# EAGLE schematic Aquila-2018-Under-DESKTOP-4DKEQLF (EAGLE 9.1.1)
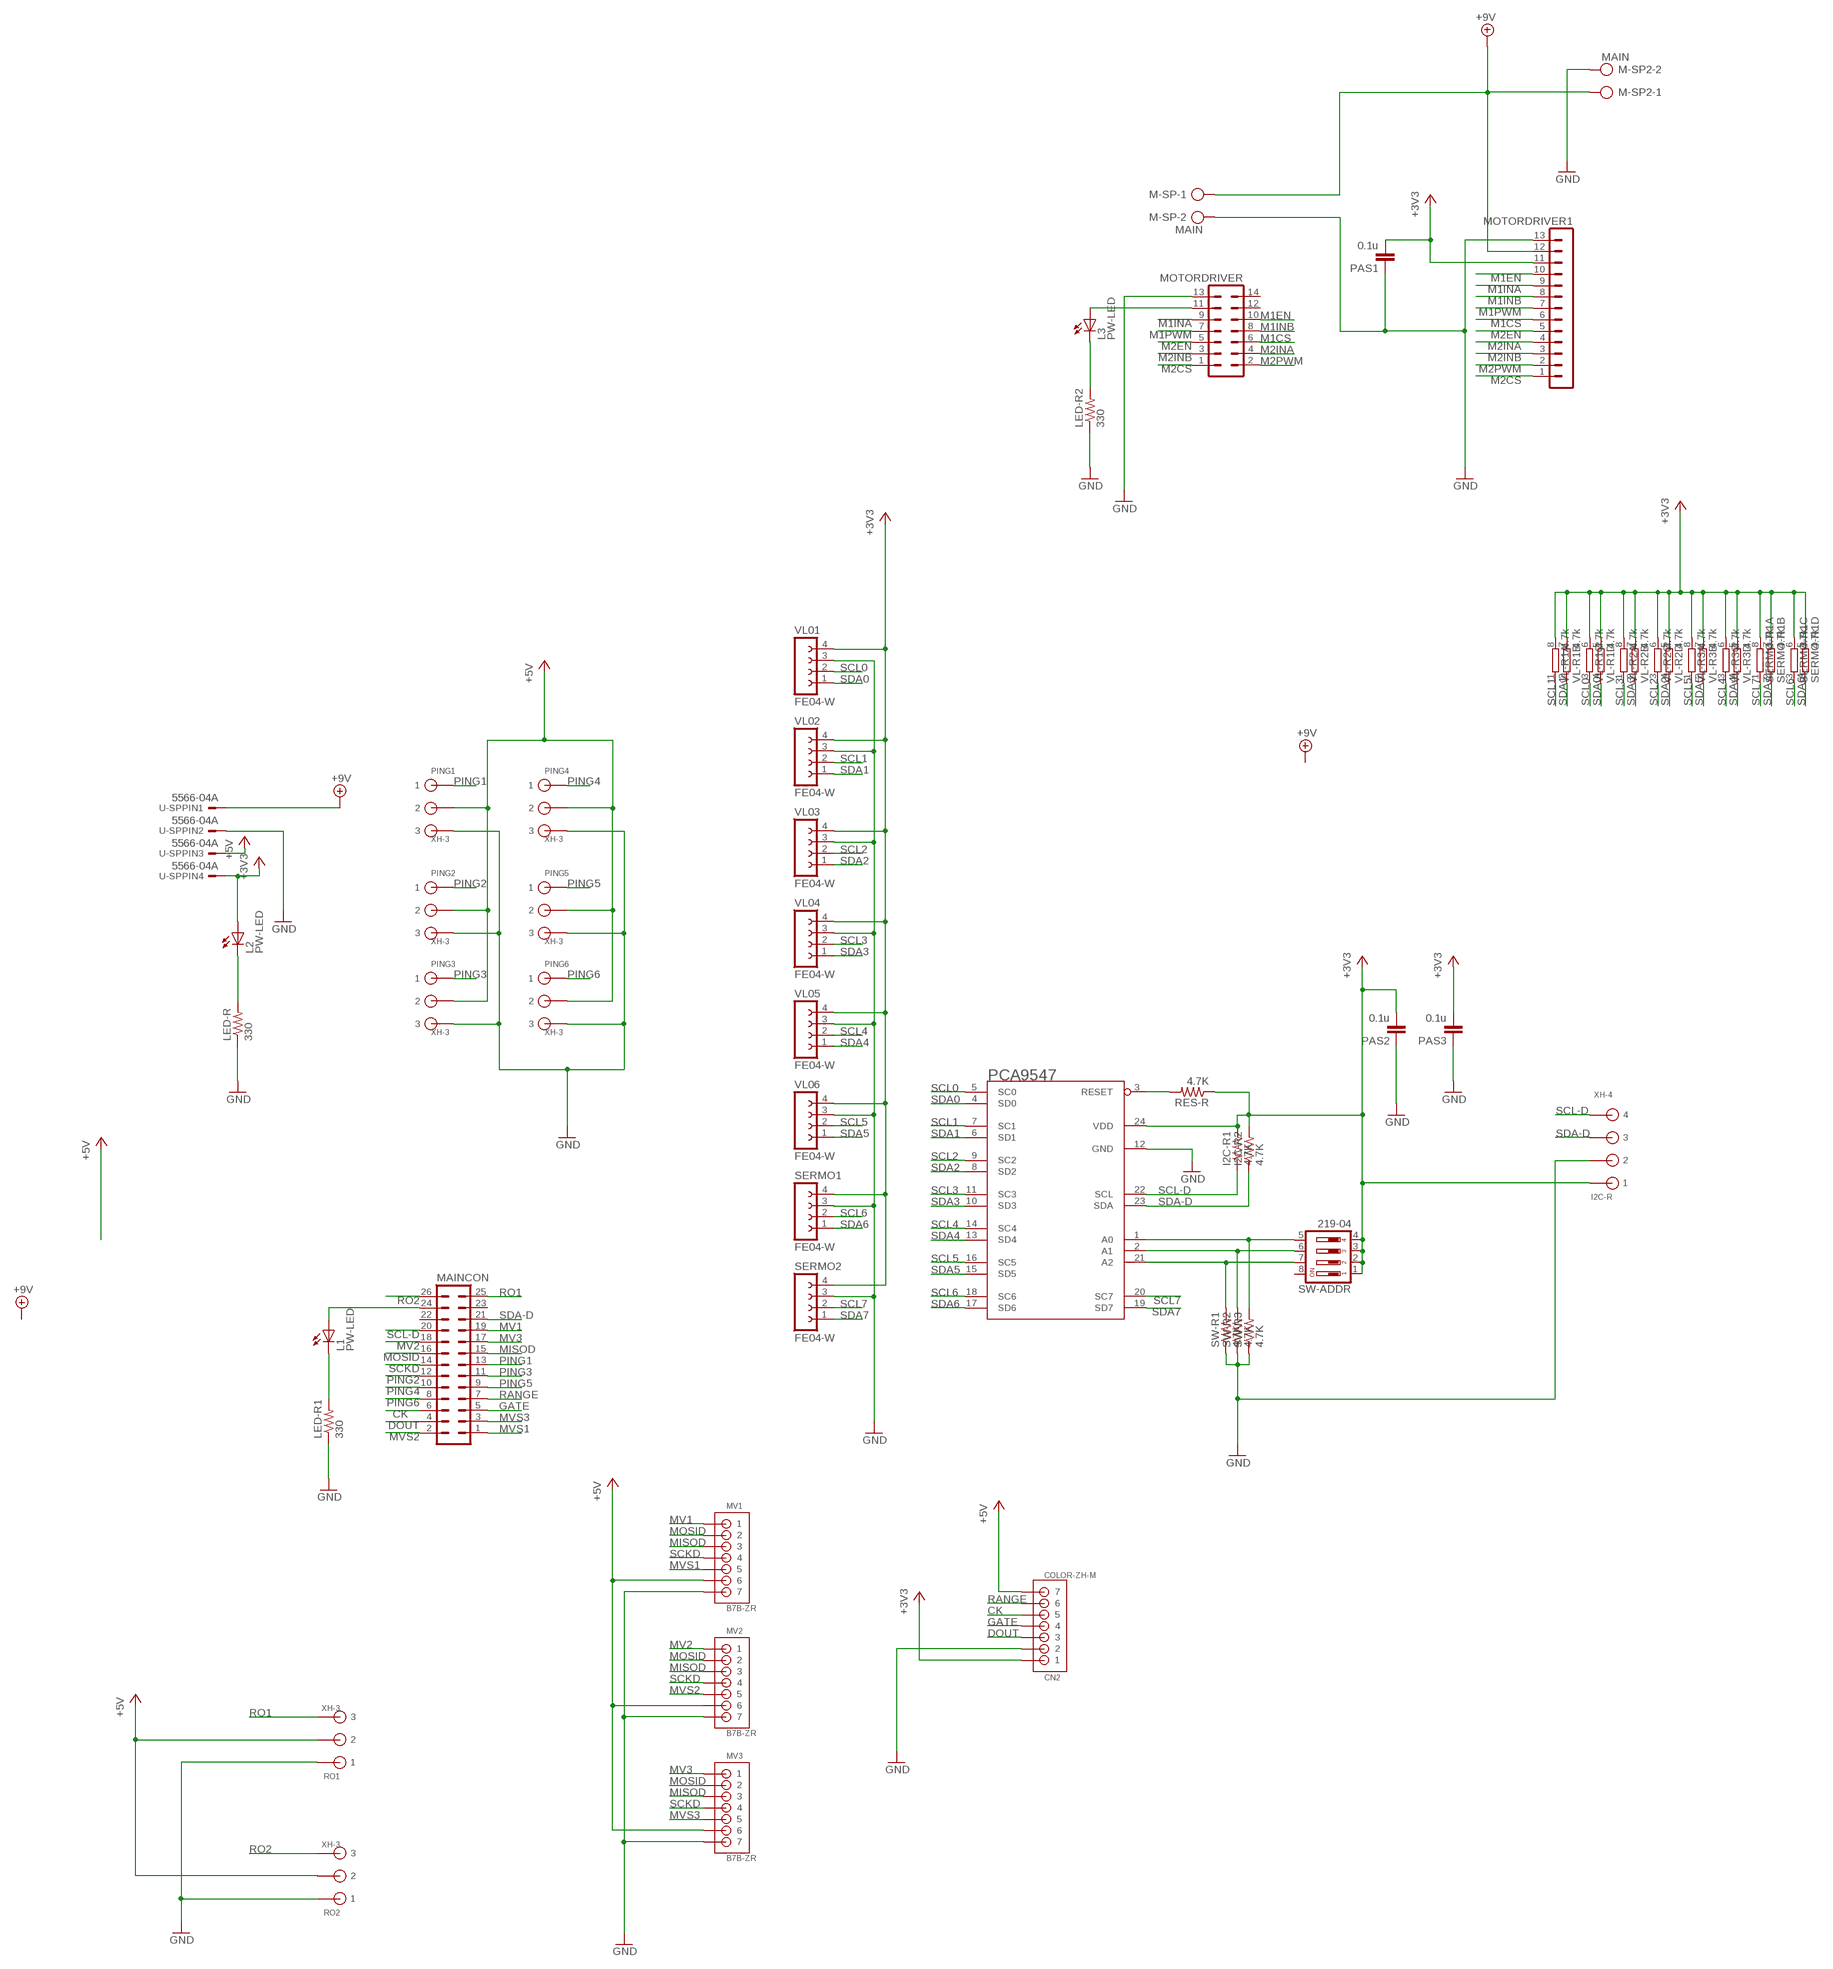
[diagram p0: schematic, sheet 1]

## Parts
CN2  COLOR-ZH-M  B7B-ZR  [B7B-ZR]
I2C-R  XH-4  [CON4]
I2C-R1  4.7K  R-US_R0805  [R0805]
I2C-R2  4.7K  R-US_R0805  [R0805]
L1  PW-LED  LEDCHIPLED_0805  [CHIPLED_0805]
L2  PW-LED  LEDCHIPLED_0805  [CHIPLED_0805]
L3  PW-LED  LEDCHIPLED_0805  [CHIPLED_0805]
LED-R  330  R-US_R0805  [R0805]
LED-R1  330  R-US_R0805  [R0805]
LED-R2  330  R-US_R0805  [R0805]
M-SP  MAIN  AK500/2  [AK500/2]
M-SP2  MAIN  AK500/2  [AK500/2]
MAINCON  ML26  [ML26]
MOTORDRIVER  ML14  [ML14]
MOTORDRIVER1  MA13-1  [MA13-1]
MV1  B7B-ZR  [B7B-ZR]
MV2  B7B-ZR  [B7B-ZR]
MV3  B7B-ZR  [B7B-ZR]
PAS1  0.1u  C-EUC0805  [C0805]
PAS2  0.1u  C-EUC0805  [C0805]
PAS3  0.1u  C-EUC0805  [C0805]
PCA9547  PCA9547  [SO24L]
PING1  XH-3  [CON3]
PING2  XH-3  [CON3]
PING3  XH-3  [CON3]
PING4  XH-3  [CON3]
PING5  XH-3  [CON3]
PING6  XH-3  [CON3]
RES-R  4.7K  R-US_R0805  [R0805]
RO1  XH-3  [CON3]
RO2  XH-3  [CON3]
SERMO1  FE04-W  [FE04-W]
SERMO2  FE04-W  [FE04-W]
SERMO-R1  4.7k  4R-NEXB28V  [EXB28V]
SW-ADDR  219-04  [CTS-219-04]
SW-R1  4.7K  R-US_R0805  [R0805]
SW-R2  4.7K  R-US_R0805  [R0805]
SW-R3  4.7K  R-US_R0805  [R0805]
U-SP  5566-04A  [5566-04A]
VL01  FE04-W  [FE04-W]
VL02  FE04-W  [FE04-W]
VL03  FE04-W  [FE04-W]
VL04  FE04-W  [FE04-W]
VL05  FE04-W  [FE04-W]
VL06  FE04-W  [FE04-W]
VL-R1  4.7k  4R-NEXB28V  [EXB28V]
VL-R2  4.7k  4R-NEXB28V  [EXB28V]
VL-R3  4.7k  4R-NEXB28V  [EXB28V]

## Nets
+3V3: CN2.1 I2C-R1.2 I2C-R2.2 I2C-R.P$1 L2.A MOTORDRIVER1.11 PAS1.2 PAS2.2 PAS3.2 PCA9547.24(VDD) RES-R.1 SERMO1.4 SERMO2.4 SERMO-R1.5 SERMO-R1.6 SERMO-R1.7 SERMO-R1.8 SW-ADDR.1 SW-ADDR.2 SW-ADDR.3 SW-ADDR.4 U-SP.4 VL01.4 VL02.4 VL03.4 VL04.4 VL05.4 VL06.4 VL-R1.5 VL-R1.6 VL-R1.7 VL-R1.8 VL-R2.5 VL-R2.6 VL-R2.7 VL-R2.8 VL-R3.5 VL-R3.6 VL-R3.7 VL-R3.8
+5V: CN2.7 MV1.6 MV2.6 MV3.6 PING1.P$2 PING2.P$2 PING3.P$2 PING4.P$2 PING5.P$2 PING6.P$2 RO1.P$2 RO2.P$2 U-SP.3
+9V: M-SP2.1 M-SP.1 MOTORDRIVER1.12 U-SP.1
CK: CN2.5 MAINCON.6
DOUT: CN2.3 MAINCON.4
GATE: CN2.4 MAINCON.5
GND: CN2.2 I2C-R.P$2 LED-R1.1 LED-R2.1 LED-R.1 M-SP2.2 M-SP.2 MOTORDRIVER1.13 MOTORDRIVER.13 MV1.7 MV2.7 MV3.7 PAS1.1 PAS2.1 PAS3.1 PCA9547.12(GND) PING1.P$3 PING2.P$3 PING3.P$3 PING4.P$3 PING5.P$3 PING6.P$3 RO1.P$1 RO2.P$1 SERMO1.3 SERMO2.3 SW-R1.1 SW-R2.1 SW-R3.1 U-SP.2 VL01.3 VL02.3 VL03.3 VL04.3 VL05.3 VL06.3
M1CS: MOTORDRIVER1.6 MOTORDRIVER.6
M1EN: MOTORDRIVER1.10 MOTORDRIVER.10
M1INA: MOTORDRIVER1.9 MOTORDRIVER.9
M1INB: MOTORDRIVER1.8 MOTORDRIVER.8
M1PWM: MOTORDRIVER1.7 MOTORDRIVER.7
M2CS: MOTORDRIVER1.1 MOTORDRIVER.1
M2EN: MOTORDRIVER1.5 MOTORDRIVER.5
M2INA: MOTORDRIVER1.4 MOTORDRIVER.4
M2INB: MOTORDRIVER1.3 MOTORDRIVER.3
M2PWM: MOTORDRIVER1.2 MOTORDRIVER.2
MISOD: MAINCON.15 MV1.3 MV2.3 MV3.3
MOSID: MAINCON.16 MV1.2 MV2.2 MV3.2
MV1: MAINCON.19 MV1.1
MV2: MAINCON.18 MV2.1
MV3: MAINCON.17 MV3.1
MVS1: MAINCON.1 MV1.5
MVS2: MAINCON.2 MV2.5
MVS3: MAINCON.3 MV3.5
N$1: PCA9547.1(A0) SW-ADDR.5 SW-R3.2
N$2: PCA9547.2(A1) SW-ADDR.6 SW-R2.2
N$3: PCA9547.21(A2) SW-ADDR.7 SW-R1.2
N$4: L2.C LED-R.2
N$5: PCA9547.3(RESET) RES-R.2
N$7: L1.C LED-R1.2
N$8: L1.A MAINCON.24
N$9: L3.C LED-R2.2
N$10: L3.A MOTORDRIVER.11
PING1: MAINCON.13 PING1.P$1
PING2: MAINCON.12 PING2.P$1
PING3: MAINCON.11 PING3.P$1
PING4: MAINCON.10 PING4.P$1
PING5: MAINCON.9 PING5.P$1
PING6: MAINCON.8 PING6.P$1
RANGE: CN2.6 MAINCON.7
RO1: MAINCON.25 RO1.P$3
RO2: MAINCON.26 RO2.P$3
SCKD: MAINCON.14 MV1.4 MV2.4 MV3.4
SCL0: PCA9547.5(SC0) VL01.2 VL-R1.3
SCL1: PCA9547.7(SC1) VL02.2 VL-R1.1
SCL2: PCA9547.9(SC2) VL03.2 VL-R2.3
SCL3: PCA9547.11(SC3) VL04.2 VL-R2.1
SCL4: PCA9547.14(SC4) VL05.2 VL-R3.3
SCL5: PCA9547.16(SC5) VL06.2 VL-R3.1
SCL6: PCA9547.18(SC6) SERMO1.2 SERMO-R1.3
SCL7: PCA9547.20(SC7) SERMO2.2 SERMO-R1.1
SCL-D: I2C-R1.1 I2C-R.P$4 MAINCON.20 PCA9547.22(SCL)
SDA0: PCA9547.4(SD0) VL01.1 VL-R1.4
SDA1: PCA9547.6(SD1) VL02.1 VL-R1.2
SDA2: PCA9547.8(SD2) VL03.1 VL-R2.4
SDA3: PCA9547.10(SD3) VL04.1 VL-R2.2
SDA4: PCA9547.13(SD4) VL05.1 VL-R3.4
SDA5: PCA9547.15(SD5) VL06.1 VL-R3.2
SDA6: PCA9547.17(SD6) SERMO1.1 SERMO-R1.4
SDA7: PCA9547.19(SD7) SERMO2.1 SERMO-R1.2
SDA-D: I2C-R2.1 I2C-R.P$3 MAINCON.21 PCA9547.23(SDA)
Unconnected: MAINCON.22 MAINCON.23 MOTORDRIVER.12 MOTORDRIVER.14 SW-ADDR.8

## Library data of the parts
CN2 MV1-MV3 = jst:B7B-ZR
I2C-R = 0@Mylibrary-main1:XH-4: Low insertion connector 4pin
I2C-R1 I2C-R2 LED-R LED-R1 LED-R2 RES-R SW-R1-SW-R3 = 0@Mylibrary-main1:R-US_: RESISTOR, American symbol
L1-L3 = led:LED: LED OSRAM: - CHIPLED LG R971, LG N971, LY N971, LG Q971, LY Q971, LO R971, LY R971 LH N974, LH R974 LS Q976, LO Q976, LY Q976 LO Q996 - Hyper CHIPLED LW Q18S LB Q993, LB Q99A, LB R99A - SideLED LS A670, LO A670, LY A670, LG A670, LP A670 LB A673, LV A673, LT A673, LW A673 LH A674 LY A675 LS A676, LA A676, LO A676, LY A676, LW A676 LS A679, LY A679, LG A679 - Hyper Micro SIDELED® LS Y876, LA Y876, LO Y876, LY Y876 LT Y87S - SmartLED LW L88C, LW L88S LB L89C, LB L89S, LG L890 LS L89K, LO L89K, LY L89K LS L896, LA L896, LO L896, LY L896 - TOPLED LS T670, LO T670, LY T670, LG T670, LP T670 LSG T670, LSP T670, LSY T670, LOP T670, LYG T670 LG T671, LOG T671, LSG T671 LB T673, LV T673, LT T673, LW T673 LH T674 LS T676, LA T676, LO T676, LY T676, LB T676, LH T676, LSB T676, LW T676 LB T67C, LV T67C, LT T67C, LS T67K, LO T67K, LY T67K, LW E67C LS E67B, LA E67B, LO E67B, LY E67B, LB E67C, LV E67C, LT E67C LW T67C LS T679, LY T679, LG T679 LS T770, LO T770, LY T770, LG T770, LP T770 LB T773, LV T773, LT T773, LW T773 LH T774 LS E675, LA E675, LY E675, LS T675 LS T776, LA T776, LO T776, LY T776, LB T776 LHGB T686 LT T68C, LB T68C - Hyper Mini TOPLED® LB M676 - Mini TOPLED Santana® LG M470 LS M47K, LO M47K, LY M47K Source: http://www.osram.convergy.de LUXEON: - LUMILED® LXK2-PW12-R00, LXK2-PW12-S00, LXK2-PW14-U00, LXK2-PW14-V00 LXK2-PM12-R00, LXK2-PM12-S00, LXK2-PM14-U00 LXK2-PE12-Q00, LXK2-PE12-R00, LXK2-PE12-S00, LXK2-PE14-T00, LXK2-PE14-U00 LXK2-PB12-K00, LXK2-PB12-L00, LXK2-PB12-M00, LXK2-PB14-N00, LXK2-PB14-P00, LXK2-PB14-Q00 LXK2-PR12-L00, LXK2-PR12-M00, LXK2-PR14-Q00, LXK2-PR14-R00 LXK2-PD12-Q00, LXK2-PD12-R00, LXK2-PD12-S00 LXK2-PH12-R00, LXK2-PH12-S00 LXK2-PL12-P00, LXK2-PL12-Q00, LXK2-PL12-R00 Source: www.luxeon.com KINGBRIGHT: KA-3528ASYC Source: www.kingbright.com
M-SP M-SP2 = con-ptr500:AK500/2: CONNECTOR; OC_FARNELL: unknown; OC_NEWARK: unknown
MAINCON = 0con-harting-ml:ML26: HARTING; OC_FARNELL: unknown; OC_NEWARK: unknown
MOTORDRIVER = 0con-harting-ml:ML14: HARTING; OC_FARNELL: unknown; OC_NEWARK: unknown
MOTORDRIVER1 = con-lstb-forprint:MA13-1: PIN HEADER; OC_FARNELL: unknown; OC_NEWARK: unknown
PAS1-PAS3 = rcl:C-EU: CAPACITOR, European symbol; SPICEPREFIX: B
PCA9547 = PCA9547:PCA9547: 8-channel I2C-Bus multiplexer with reset NXP
PING1-PING6 = 0@Mylibrary-main1:XH-3: low insertion CON
RO1 RO2 = forprint:XH-3: low insertion CON
SERMO1 SERMO2 VL01-VL06 = 0@con-lsta:FE04-W
SERMO-R1 VL-R1-VL-R3 = resistor-dil:4R-N: Array Chip Resistor Source: RS Component / Phycomp; OC_FARNELL: unknown; OC_NEWARK: unknown
SW-ADDR = switch-dil:219-04*: Surface Mount DIP Switch Series 219 SMT CTS Electronic Components Sourc: www.ctscorp.com; OC_FARNELL: unknown; OC_NEWARK: unknown
U-SP = con-molex:5566-04A